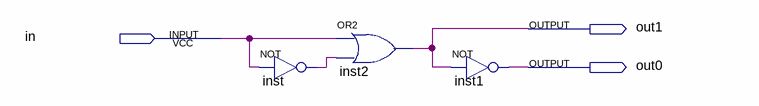
[diagram p0: schematic sheet]
// Quartus schematic const_out_1_0.bdf as structural Verilog: 3 symbols, 3 pins
module const_out_1_0 (
  input  in,
  output out1,
  output out0
);

  wire inst_out;

  not inst (inst_out, in);
  or inst2 (out1, in, inst_out);
  not inst1 (out0, out1);
endmodule
